# Altium schematic sheet QCW Bridge PCBA.SchDoc
size A4
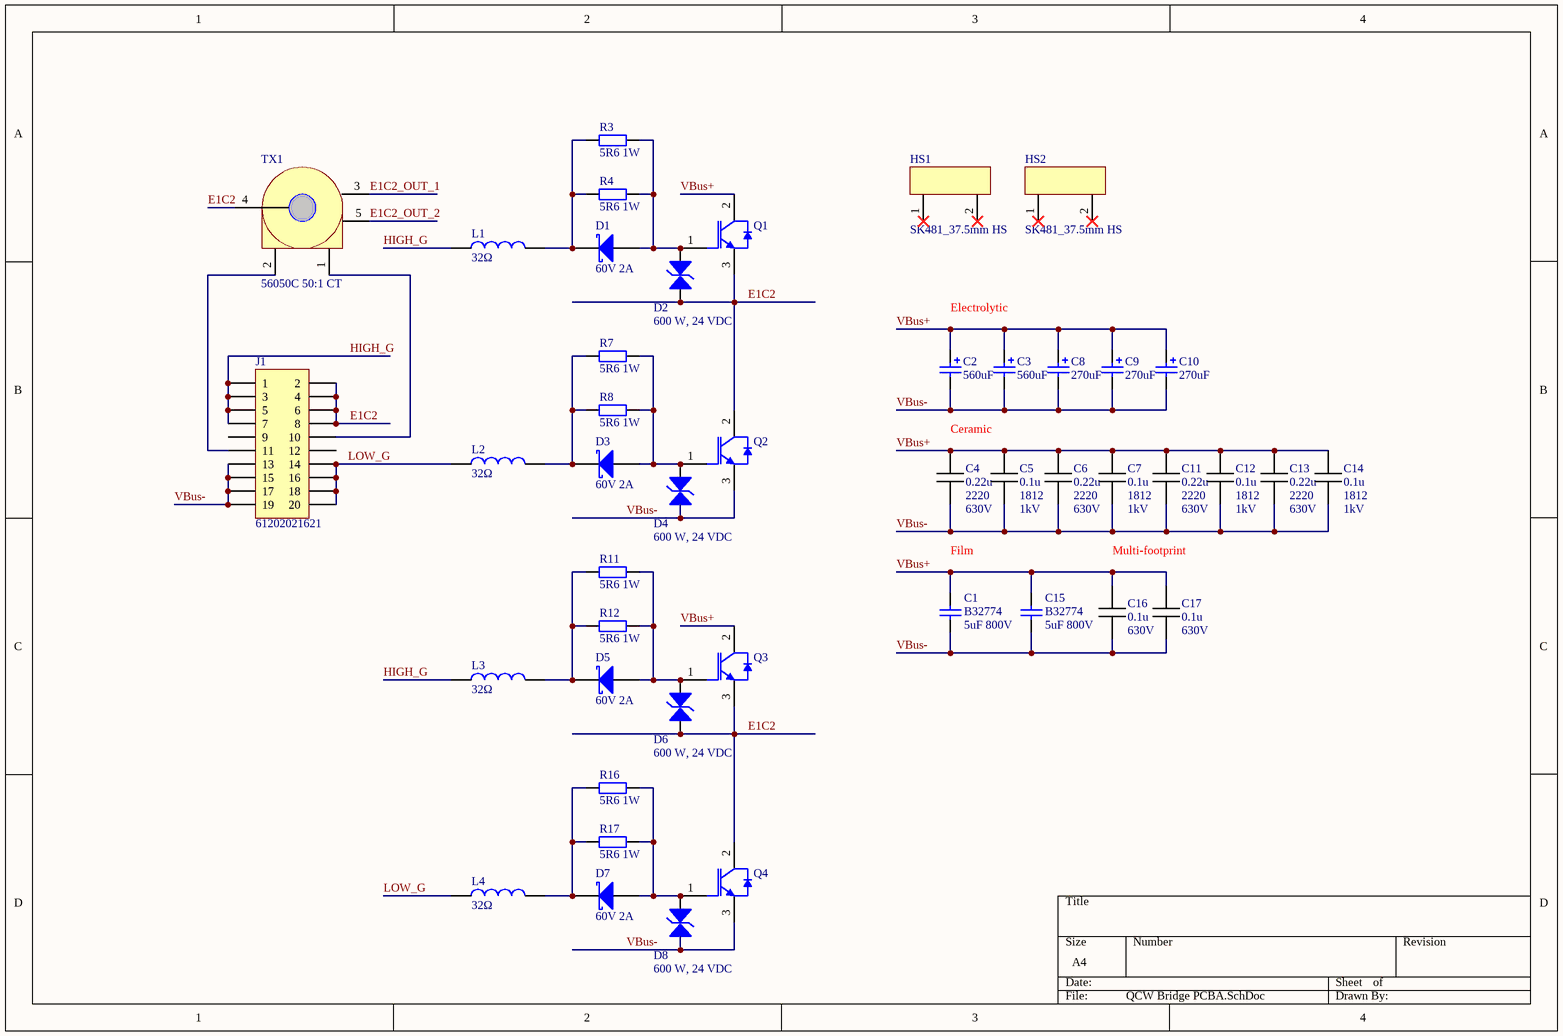
[diagram p0: QCW Bridge PCBA.SchDoc]

## Parts
C1  B32774  value 5uF 800V  [B32774 5uF 800V]
C2  560uF  [WCAP-AIL8_35x47]
C3  560uF  [WCAP-AIL8_35x47]
C4  Capacitance: 0.22u  package: 2220  voltage: 630V  [2220C]  (hidden comment: Capacitor)
C5  Capacitance: 0.1u  package: 1812  voltage: 1kV  [1812C]  (hidden comment: Capacitor)
C6  Capacitance: 0.22u  package: 2220  voltage: 630V  [2220C]  (hidden comment: Capacitor)
C7  Capacitance: 0.1u  package: 1812  voltage: 1kV  [1812C]  (hidden comment: Capacitor)
C8  270uF  [WCAP-AIL8_25x46]
C9  270uF  [WCAP-AIL8_25x46]
C10  270uF  [WCAP-AIL8_25x46]
C11  Capacitance: 0.22u  package: 2220  voltage: 630V  [2220C]  (hidden comment: Capacitor)
C12  Capacitance: 0.1u  package: 1812  voltage: 1kV  [1812C]  (hidden comment: Capacitor)
C13  Capacitance: 0.22u  package: 2220  voltage: 630V  [2220C]  (hidden comment: Capacitor)
C14  Capacitance: 0.1u  package: 1812  voltage: 1kV  [1812C]  (hidden comment: Capacitor)
C15  B32774  value 5uF 800V  [B32774 5uF 800V]
C16  Capacitance: 0.1u  voltage: 630V  [Cap_multi_footprint]  (hidden comment: Capacitor)
C17  Capacitance: 0.1u  voltage: 630V  [Cap_multi_footprint]  (hidden comment: Capacitor)
D1  60V 2A  [DO-214AA_(SMB-J-BEND)_UNI]
D2  600 W, 24 VDC  [DO-214AA_Bidirectional]
D3  60V 2A  [DO-214AA_(SMB-J-BEND)_UNI]
D4  600 W, 24 VDC  [DO-214AA_Bidirectional]
D5  60V 2A  [DO-214AA_(SMB-J-BEND)_UNI]
D6  600 W, 24 VDC  [DO-214AA_Bidirectional]
D7  60V 2A  [DO-214AA_(SMB-J-BEND)_UNI]
D8  600 W, 24 VDC  [DO-214AA_Bidirectional]
HS1  SK481_37.5mm HS  [SK 481 37.5]
HS2  SK481_37.5mm HS  [SK 481 37.5_FLIP]
J1  61202021621  [61202021621]
L1  32Ω  [WE-CBF_1206_High Speed]
L2  32Ω  [WE-CBF_1206_High Speed]
L3  32Ω  [WE-CBF_1206_High Speed]
L4  32Ω  [WE-CBF_1206_High Speed]
Q1  (no value)  [TO-247]
Q2  (no value)  [TO-247]
Q3  (no value)  [TO-247]
Q4  (no value)  [TO-247]
R3  value 5R6 1W  [RES_2512]  (hidden comment: Res2)
R4  value 5R6 1W  [RES_2512]  (hidden comment: Res2)
R7  value 5R6 1W  [RES_2512]  (hidden comment: Res2)
R8  value 5R6 1W  [RES_2512]  (hidden comment: Res2)
R11  value 5R6 1W  [RES_2512]  (hidden comment: Res2)
R12  value 5R6 1W  [RES_2512]  (hidden comment: Res2)
R16  value 5R6 1W  [RES_2512]  (hidden comment: Res2)
R17  value 5R6 1W  [RES_2512]  (hidden comment: Res2)
TX1  56050C 50:1 CT  [KMP_5600_ALT]

## Nets
E1C2: D2.2 D6.2 J1.2 J1.4 J1.6 J1.8 Q1.3(E) Q2.2(C) Q3.3(E) Q4.2(C) TX1.4
E1C2_OUT_1: TX1.3
E1C2_OUT_2: TX1.5
HIGH_G: J1.1 J1.3 J1.5 J1.7 L1.1 L3.1
LOW_G: J1.14 J1.16 J1.18 J1.20 L2.1 L4.1
VBus+: C1.1 C2.1(P) C3.1(P) C4.1 C5.1 C6.1 C7.1 C8.1(P) C9.1(P) C10.1(P) C11.1 C12.1 C13.1 C14.1 C15.1 C16.1 C17.2 Q1.2(C) Q3.2(C)
VBus-: C1.2 C2.2(N) C3.2(N) C4.2 C5.2 C6.2 C7.2 C8.2(N) C9.2(N) C10.2(N) C11.2 C12.2 C13.2 C14.2 C15.2 C16.2 C17.1 D4.2 D8.2 J1.13 J1.15 J1.17 J1.19 Q2.3(E) Q4.3(E)
NetD1_A: D1.A D2.1 Q1.1(G) R3.2 R4.2
NetD1_K: D1.K L1.2 R3.1 R4.1
NetD3_A: D3.A D4.1 Q2.1(G) R7.2 R8.2
NetD3_K: D3.K L2.2 R7.1 R8.1
NetD5_A: D5.A D6.1 Q3.1(G) R11.2 R12.2
NetD5_K: D5.K L3.2 R11.1 R12.1
NetD7_A: D7.A D8.1 Q4.1(G) R16.2 R17.2
NetD7_K: D7.K L4.2 R16.1 R17.1
NetJ1_10: J1.10 TX1.1
NetJ1_11: J1.11 TX1.2

Not connected (* = marked no-connect by the designer): HS1 1* 2*; HS2 1* 2*; J1 9 12

## Notes on the sheet
- Electrolytic
- Ceramic
- Film
- Multi-footprint

## Library data of the parts
C1 C15 = Cap: Capacitor; Published: 8-Jun-2000; LatestRevisionDate: 17-Jul-2002; LatestRevisionNote: Re-released for DXP Platform.; PackageReference: RAD-0.3; Publisher: Altium Limited; PackageDescription: Radial Cap, Thru-Hole; 2 Leads; 0.3 in Pin Spacing
C2 C3 = WCAP-AIL8, 861101486027: WCAP-AIL8 Aluminum Electrolytic Capacitors, 560uF; RatedVoltage: 450V; PublishedDate: July 2016; Publisher: Wurth Elektronik; ComponentLink1Description: Manufacturer; ComponentLink1URL: http://www.we-online.de; ComponentLink2Description: Datasheet; ComponentLink2URL: http://katalog.we-online.com/pbs/datasheet/861101486027.pdf; PartNumber: 861101486027; Value: 560uF; Size: 35mmx47mm
C8-C10 = WCAP-AIL8, 861101484015: WCAP-AIL8 Aluminum Electrolytic Capacitors, 270uF; RatedVoltage: 450V; PublishedDate: July 2016; Publisher: Wurth Elektronik; ComponentLink1Description: Manufacturer; ComponentLink1URL: http://www.we-online.de; ComponentLink2Description: Datasheet; ComponentLink2URL: http://katalog.we-online.com/pbs/datasheet/861101484015.pdf; PartNumber: 861101484015; Value: 270uF; Size: 25mmx46mm
D1 D3 D5 D7 = SS26: SS26 Schottky rectifier
D2 D4 D6 D8 = WE-TVSP DO-214AA, 824521241: WE-TVSP Power TVS Diode, bidirectional, 600 W, 24 VDC; Manufacturer: Wurth Elektronik; partNo: 824521241; ComponentLink1Description: Manufacturer; ComponentLink1URL: http://www.we-online.de; Created by: Baojun Chen; Created Date: Nov.2015; ComponentLink2Description: Datasheet; ComponentLink2URL: http://katalog.we-online.de/pbs/datasheet/824521241.pdf
HS1 HS2 = SK_481_37.5
J1 = 61202021621: WR-BHD 2.54mm Male Box Header; Manufacturer: Wurth Elektronik; ComponentLink1 Description: Manufacturer; ComponentLink2 Description: Datasheet; NoPins: 20; Created Date: March 2016; partNo: 61202021621; ComponentLink1URL: http://www.we-online.com; ComponentLink2URL: http://katalog.we-online.de/em/datasheet/6120xx21621.pdf; Created by: Baojun Chen
L1-L4 = WE-CBF, 7427921: WE-CBF SMD EMI Suppression Ferrite Bead, 1206, 32Ω; Type: High Speed; PublishedDate: Aug 2016; Publisher: Wurth Elektronik; ComponentLink1Description: Manufacturer; ComponentLink1URL: http://www.we-online.de; ComponentLink2Description: Datasheet; ComponentLink2URL: http://katalog.we-online.de/pbs/datasheet/7427921.pdf; PartNumber: 7427921; Value: 32Ω; Size: 1206
Q1-Q4 = TO-247_IGBT_V: IGBT, TO-247, Vertical
R3 R4 R7 R8 R11 R12 R16 R17 = Res2: Resistor; Published: 8-Jun-2000; LatestRevisionDate: 17-Jul-2002; LatestRevisionNote: Re-released for DXP Platform.; PackageReference: AXIAL-0.4; Publisher: Altium Limited; PackageDescription: Axial Device, Thru-Hole; 2 Leads; 0.4 in Pin Spacing
TX1 = 56050C_ALT: Murata 56050C 10A 50:1 CT
C4-C7 C11-C14 C16 C17 = Capacitor: tolerance: *; type: *; material: *